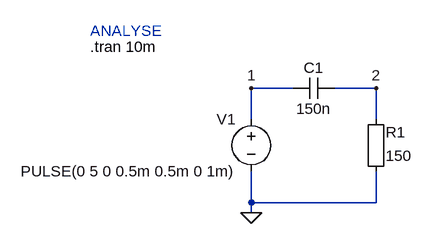
[diagram p0: schematic bsp134_reisch.asc]
bsp134_reisch.asc, the LTspice schematic file:
Version 4.1
SHEET 1 880 680
WIRE 96 80 32 80
WIRE 224 80 160 80
WIRE 32 128 32 80
WIRE 224 128 224 80
WIRE 32 256 32 208
WIRE 224 256 224 208
WIRE 224 256 32 256
WIRE 32 272 32 256
FLAG 32 272 0
FLAG 32 80 1
FLAG 224 80 2
SYMBOL cap 160 64 R90
WINDOW 0 0 32 VBottom 2
WINDOW 3 32 32 VTop 2
SYMATTR InstName C1
SYMATTR Value 150n
SYMBOL EuropeanResistor 208 224 M180
WINDOW 0 31 76 Left 2
WINDOW 3 31 40 Left 2
SYMATTR InstName R1
SYMATTR Value 150
SYMBOL voltage 32 112 M0
WINDOW 123 0 0 Left 0
WINDOW 39 0 0 Left 0
SYMATTR InstName V1
SYMATTR Value PULSE(0 5 0 0.5m 0.5m 0 1m)
TEXT -216 16 Left 2 !.tran 10m
TEXT -216 -8 Left 2 ;ANALYSE

The netlist it stands for:
* bsp134_reisch.asc
C1 2 1 150n
R1 0 2 150
V1 1 0 PULSE(0 5 0 0.5m 0.5m 0 1m)
.tran 10m
* ANALYSE
.backanno
.end

* Results of the author's LTspice run, read from the files saved beside the schematic
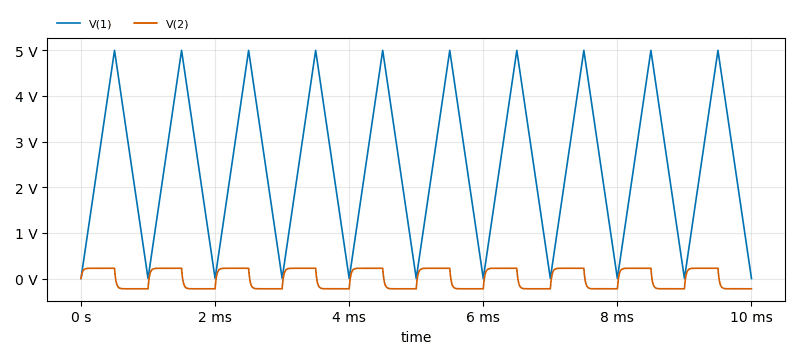
[diagram p1: Transient Analysis of bsp134_reisch.asc, plotted from the saved traces]
* Transient Analysis, 1 run:
*   V(1): min 0 V, max 5 V, average 2.5 V, rms 2.986 V, last 0 V
*   V(2): min -225.1 mV, max 225.1 mV, average 494.9 µV, rms 214.9 mV, last -225 mV